# Altium project IN14.PrjPCB
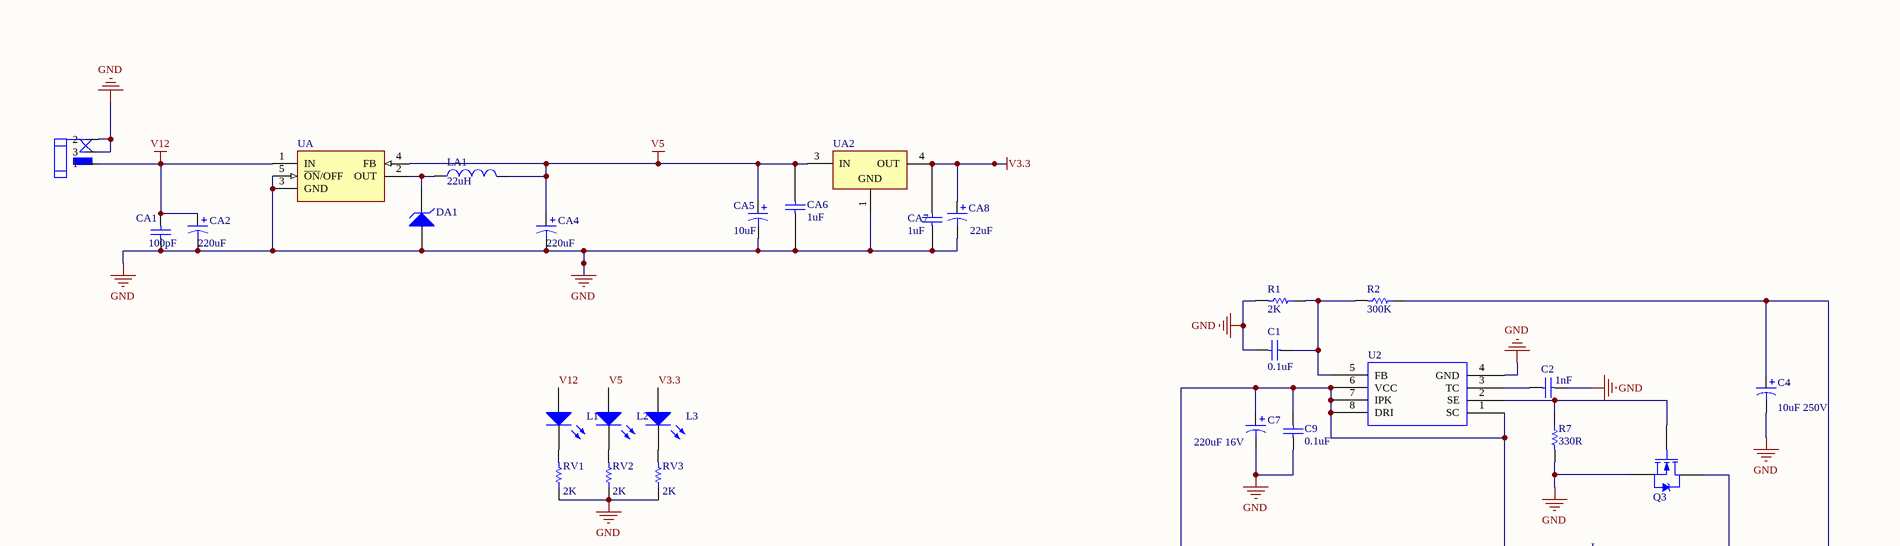
[diagram p0: IN14.SchDoc, top left]
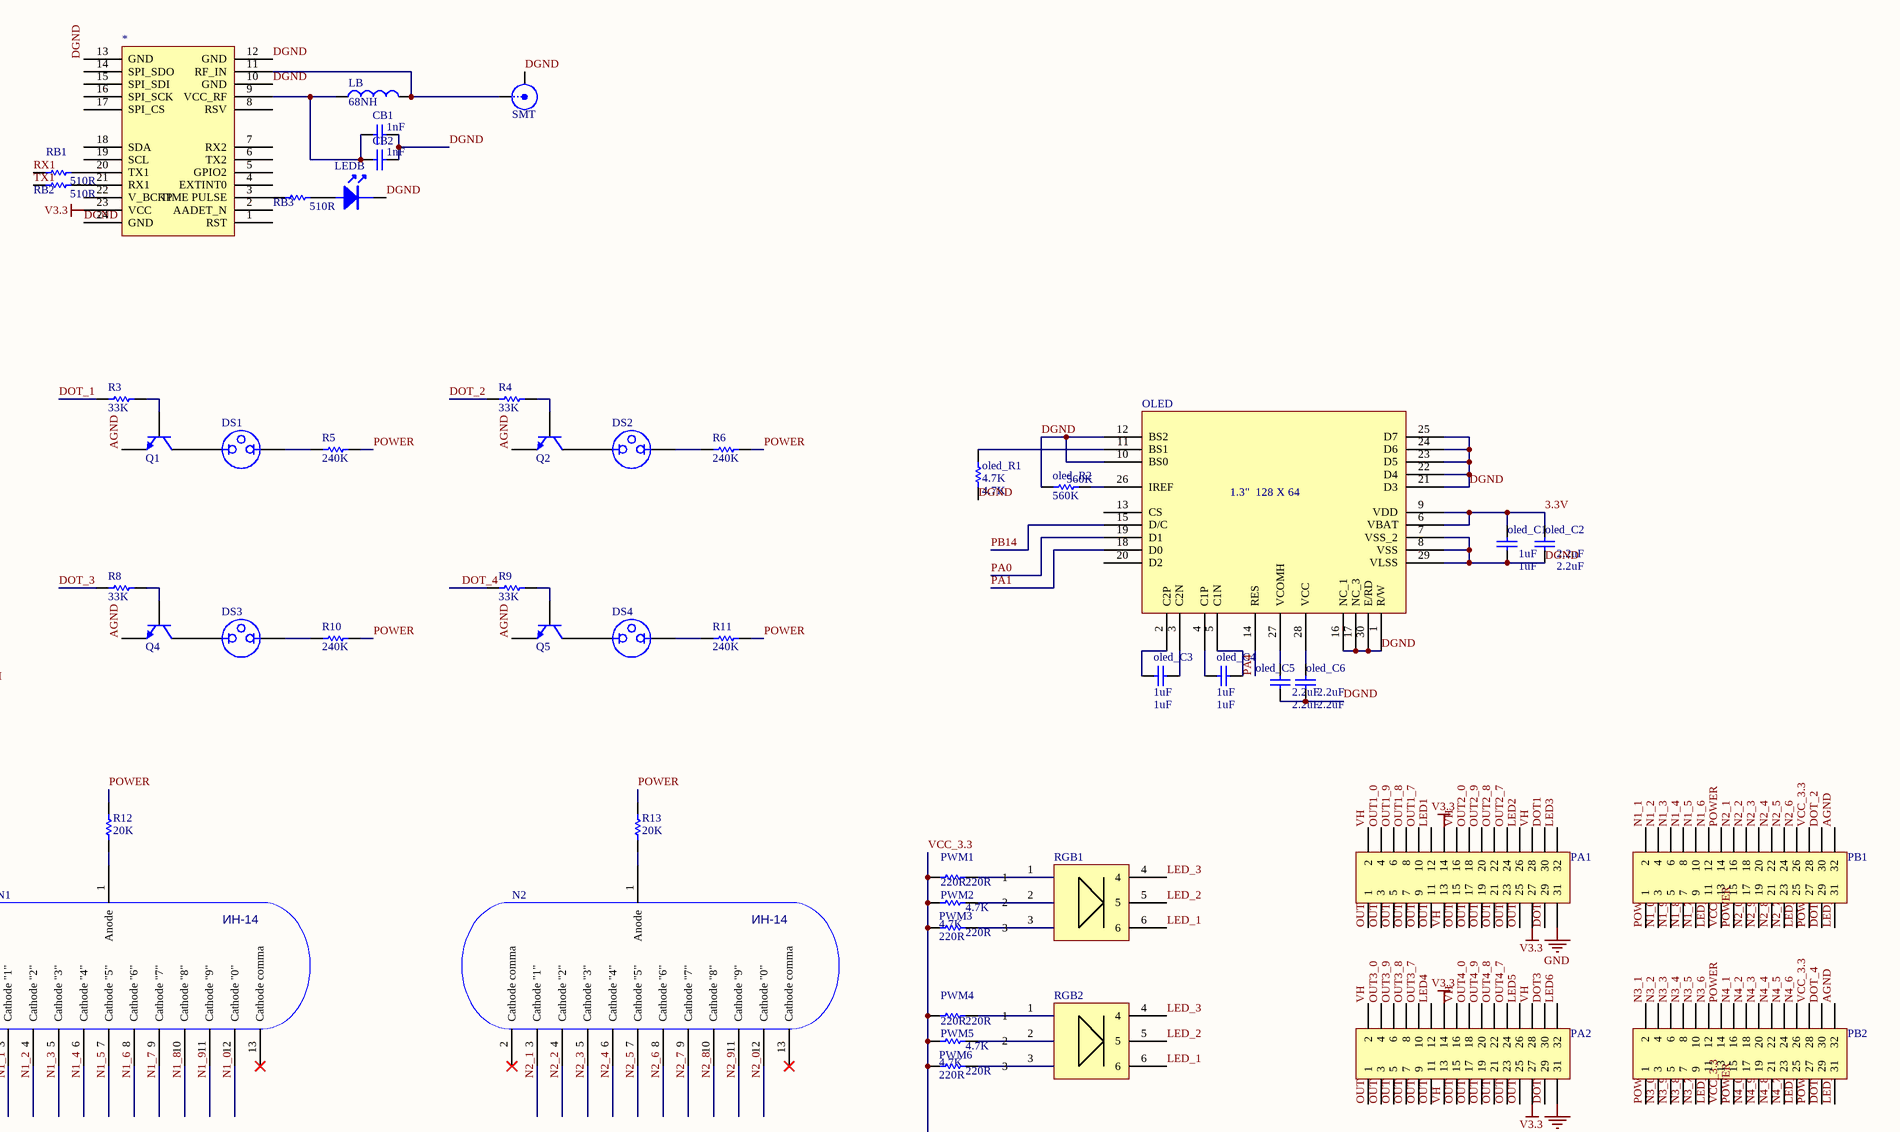
[diagram p1: IN14.SchDoc, top right]
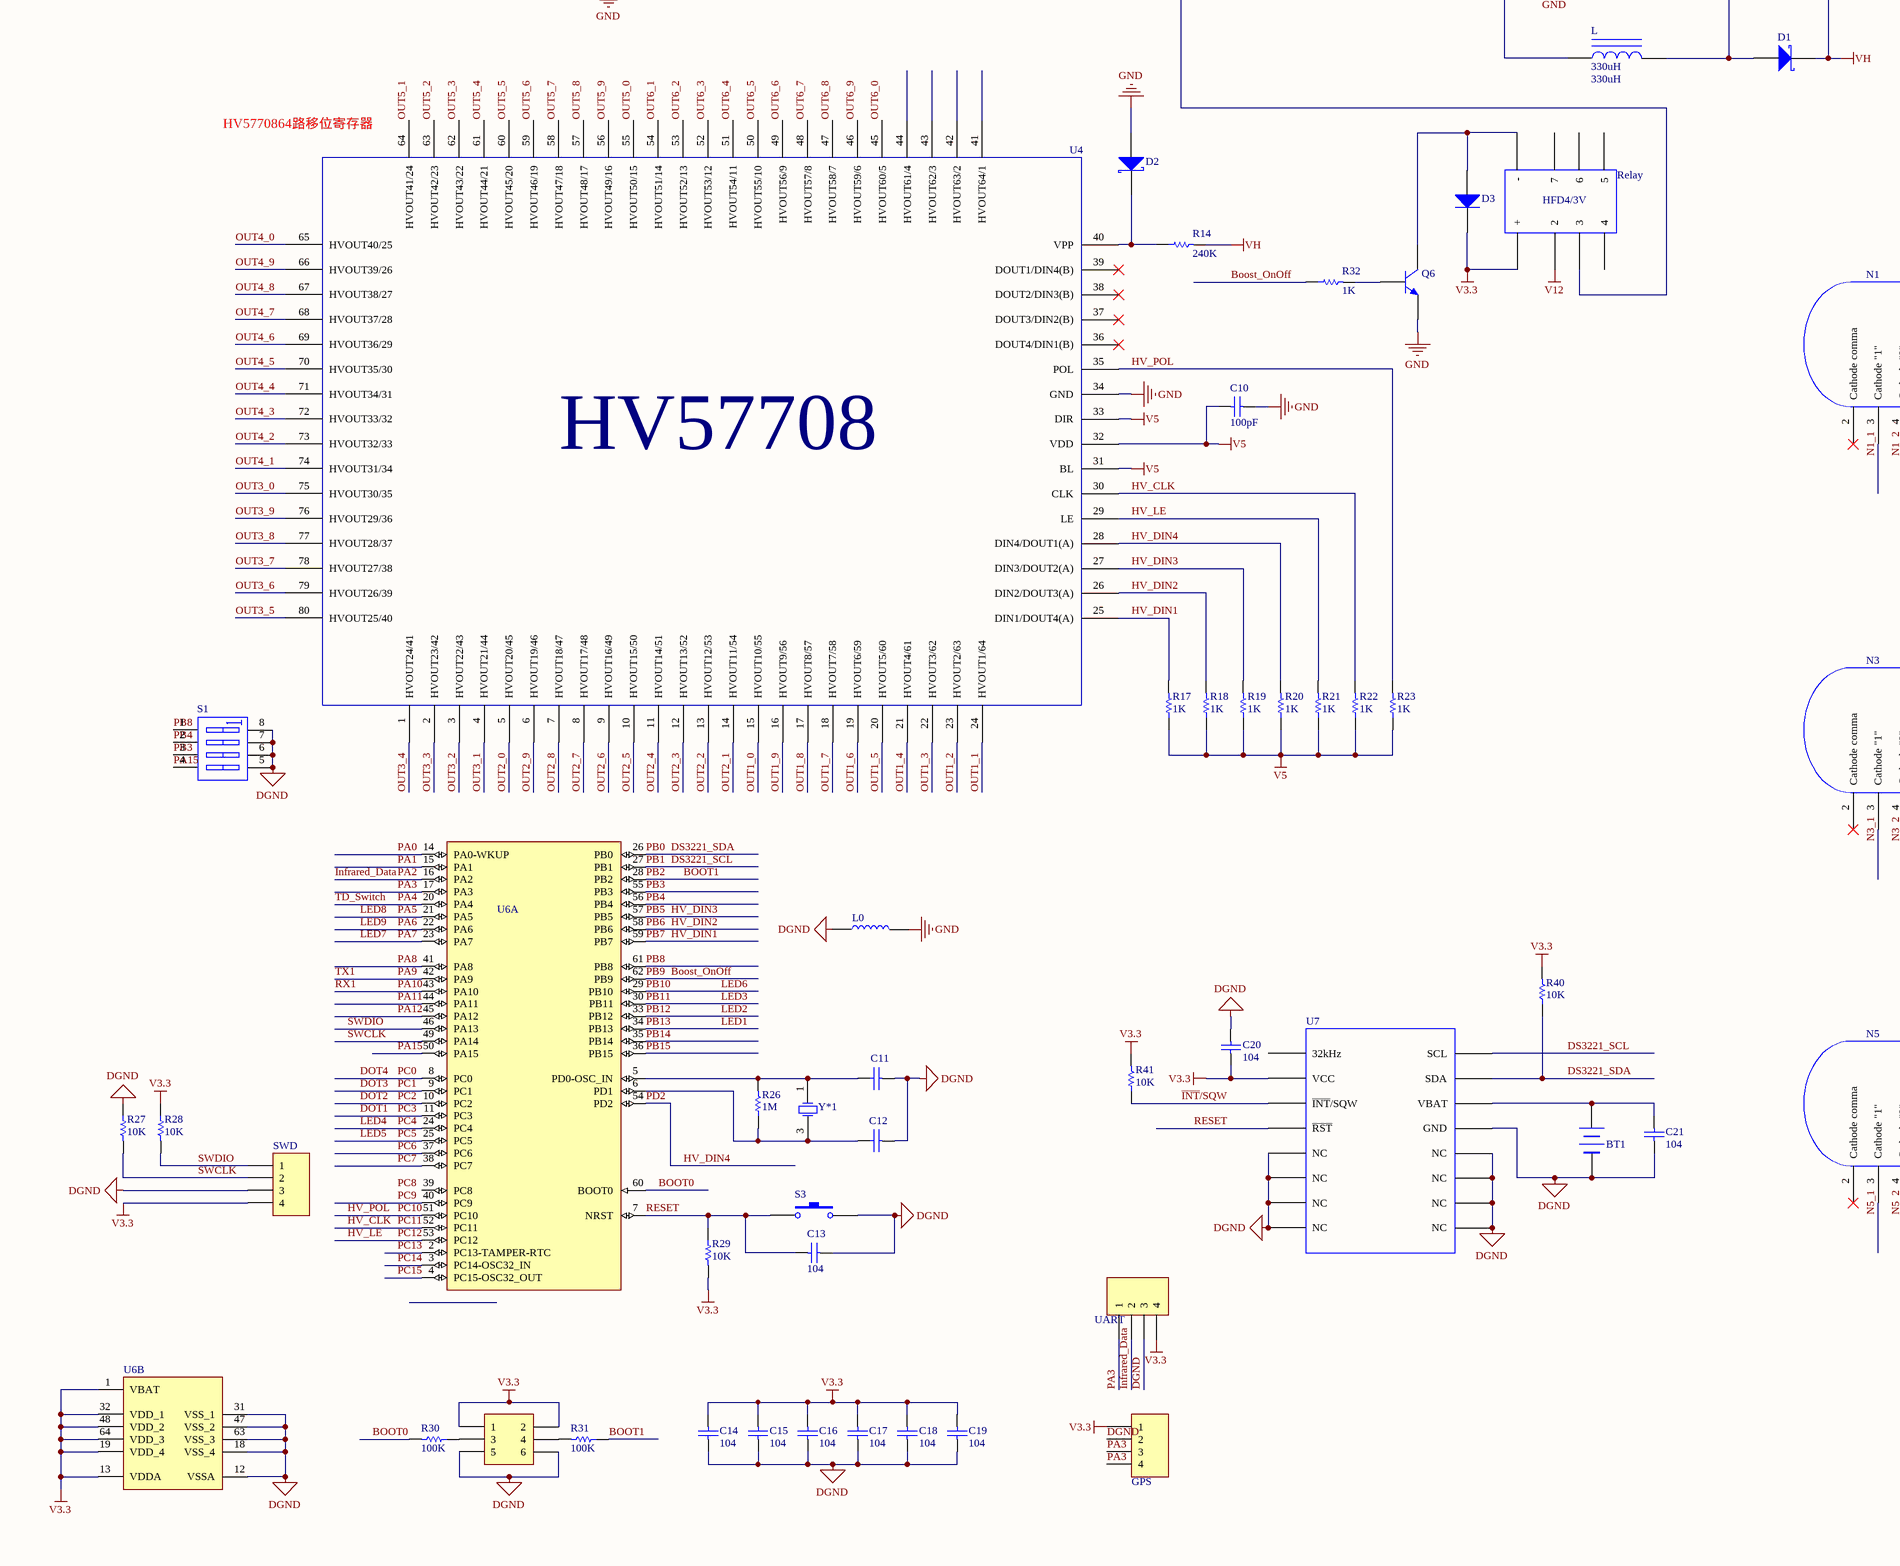
[diagram p2: IN14.SchDoc, bottom left]
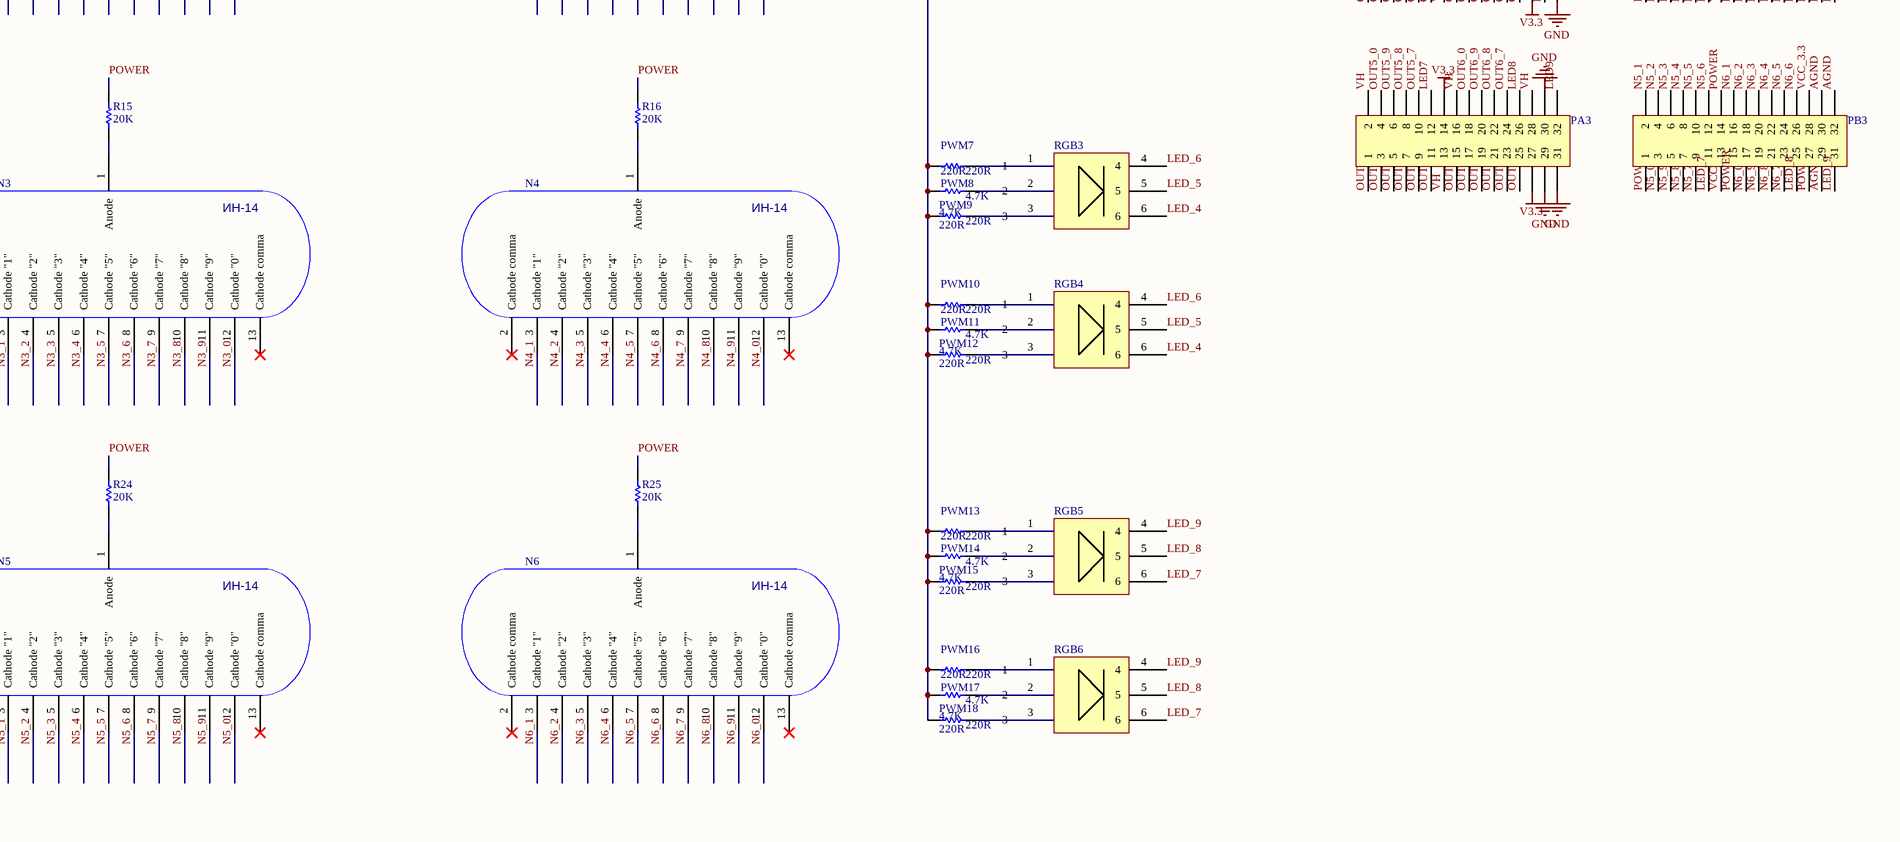
[diagram p3: IN14.SchDoc, bottom right]
1 sheet, 151 parts. Net scope: global (net labels, ports and power ports of the same name join across sheets).
Board file: IN14.PcbDoc

## Sheet IN14.SchDoc
size A1

### Parts
*  (no value)  [UM220]
BOOT  (no value)  [HDR2X3]
BT1  (no value)  [BAT1220]
C1  0.1uF  [C0603]
C2  1nF  [C0603]
C4  10uF 250V  [电容卧放2.54mm-1]
C7  220uF 16V  [HONOR_63X77]
C9  0.1uF  [C0603]
C10  100pF  [C0603]
C11  (no value)  [C0603]
C12  (no value)  [C0603]
C13  104  [C0603]
C14  104  [C0603]
C15  104  [C0603]
C16  104  [C0603]
C17  104  [C0603]
C18  104  [C0603]
C19  104  [C0603]
C20  104  [C0603]
C21  104  [C0603]
CA1  100pF  [C0603]
CA2  220uF  [CAP]
CA4  220uF  [CAP]
CA5  10uF  [3528]
CA6  1uF  [C0603]
CA7  1uF  [C0603]
CA8  22uF  [3528]
CB1  1nF  [C0603]
CB2  1nF  [C0603]
D1  (no value)  [SMB]
D2  (no value)  [LL-34]
D3  (no value)  [1N4007W]
DA1  (no value)  [3528]
DC1  (no value)  [DC-005]
DS1  (no value)  [PIN2]
DS2  (no value)  [PIN2]
DS3  (no value)  [PIN2]
DS4  (no value)  [PIN2]
GPS  Header 4  [HDR4X1_A]  (value not drawn)
L  330uH  [GDRH127]
L0  (no value)  [0805]
L1  (no value)  [C0603]
L2  (no value)  [C0603]
L3  (no value)  [C0603]
LA1  22uH  [LL]
LB  68NH  [0805]
LEDB  (no value)  [C0603]
N1  (no value)  [IN14]
N2  (no value)  [IN14]
N3  (no value)  [IN14]
N4  (no value)  [IN14]
N5  (no value)  [IN14]
N6  (no value)  [IN14]
OLED  (no value)  [OLED]
oled_C1  1uF  [C0603]
oled_C2  2.2uF  [C0603]
oled_C3  1uF  [C0603]
oled_C4  1uF  [C0603]
oled_C5  2.2uF  [C0603]
oled_C6  2.2uF  [C0603]
oled_R1  4.7K  [R0603]
oled_R2  560K  [R0603]
PA1  (no value)  [HDR2X16]
PA2  (no value)  [HDR2X16]
PA3  (no value)  [HDR2X16]
PB1  (no value)  [贴片32]
PB2  (no value)  [贴片32]
PB3  (no value)  [贴片32]
PWM1  220R  [R0603]
PWM2  4.7K  [R0603]
PWM3  220R  [R0603]
PWM4  220R  [R0603]
PWM5  4.7K  [R0603]
PWM6  220R  [R0603]
PWM7  220R  [R0603]
PWM8  4.7K  [R0603]
PWM9  220R  [R0603]
PWM10  220R  [R0603]
PWM11  4.7K  [R0603]
PWM12  220R  [R0603]
PWM13  220R  [R0603]
PWM14  4.7K  [R0603]
PWM15  220R  [R0603]
PWM16  220R  [R0603]
PWM17  4.7K  [R0603]
PWM18  220R  [R0603]
Q1  (no value)  [SOT-23-3L]
Q2  (no value)  [SOT-23-3L]
Q3  (no value)  [TO-263-2L]
Q4  (no value)  [SOT-23-3L]
Q5  (no value)  [SOT-23-3L]
Q6  (no value)  [SOT-323]
R1  2K  [R0603]
R2  300K  [R0603]
R3  33K  [R0603]
R4  33K  [R0603]
R5  240K  [R0603]
R6  240K  [R0603]
R7  value 330R  [R0603]  (hidden comment: 330)
R8  33K  [R0603]
R9  33K  [R0603]
R10  240K  [R0603]
R11  240K  [R0603]
R12  20K  [R0603]
R13  20K  [R0603]
R14  240K  [R0603]
R15  20K  [R0603]
R16  20K  [R0603]
R17  1K  [R0603]
R18  1K  [R0603]
R19  1K  [R0603]
R20  1K  [R0603]
R21  1K  [R0603]
R22  1K  [R0603]
R23  1K  [R0603]
R24  20K  [R0603]
R25  20K  [R0603]
R26  1M  [R0603]
R27  10K  [R0603]
R28  10K  [R0603]
R29  10K  [R0603]
R30  100K  [R0603]
R31  100K  [R0603]
R32  1K  [R0603]
R40  10K  [R0603]
R41  10K  [R0603]
RB1  510R  [R0603]
RB2  510R  [R0603]
RB3  510R  [R0603]
Relay  (no value)  [HFD4]
RGB1  (no value)  [二极管5050]
RGB2  (no value)  [二极管5050]
RGB3  (no value)  [二极管5050]
RGB4  (no value)  [二极管5050]
RGB5  (no value)  [二极管5050]
RGB6  (no value)  [二极管5050]
RV1  2K  [C0603]
RV2  2K  [C0603]
RV3  2K  [C0603]
S1  (no value)  [dip8]
S3  (no value)  [贴片按键（红头）]
SMT  (no value)  [SMB_V-RJ45]
SWD  (no value)  [HDR1X4]
U2  (no value)  [SOIC8]
U4  (no value)  [HV57708PG]
U6  (no value)  [LQFP64_N]  (parts A,B of 2)
U7  (no value)  [SOP16_75MM]
UA  (no value)  [TO-263-5]
UA2  (no value)  [SOT223_N]
UART  (no value)  [HDR4X1_A]
Y*1  (no value)  [A3225]

### Nets
DGND: *.10(GND) *.12(GND) *.13(GND) *.24(GND) BOOT.5 BOOT.6 BT1.2(-) C11.1 C12.1 C13.2 C14.1 C15.1 C16.1 C17.1 C18.1 C19.1 C20.2 C21.1 CB1.1 CB2.1 GPS.2 L0.1 LEDB.2 OLED.1(R/W) OLED.7(VSS_2) OLED.8(VSS) OLED.10(BS0) OLED.12(BS2) OLED.16(NC_1) OLED.17(NC_3) OLED.21(D3) OLED.22(D4) OLED.23(D5) OLED.24(D6) OLED.25(D7) OLED.29(VLSS) OLED.30(E/RD) oled_C1.1 oled_C2.1 oled_C5.1 oled_C6.1 oled_R1.1 oled_R2.1 R27.1 S1.5(B4) S1.6(B3) S1.7(B2) S1.8(B1) S3.2 SMT.2(Y) SWD.3 U6.12(VSSA) U6.18(VSS_4) U6.31(VSS_1) U6.47(VSS_2) U6.63(VSS_3) U7.5(NC) U7.6(NC) U7.7(NC) U7.8(NC) U7.9(NC) U7.10(NC) U7.11(NC) U7.12(NC) U7.13(GND) UART.3
GND: C1.2 C2.1 C4.2 C7.2 C9.1 C10.1 CA1.1 CA2.2 CA4.2 CA5.2 CA6.1 CA7.2 CA8.2 D2.1(A) DA1.1(A) DC1.2 DC1.3 L0.2 PA1.31 PA2.31 PA3.29 PA3.30 PA3.31 Q3.3(S) Q6.2(E) R1.2 R7.2 RV1.1 RV2.1 RV3.1 U2.4(GND) U4.34(GND) UA.3(GND) UA.5(~{ON}/OFF) UA2.1(GND)
V3.3: *.23(VCC) BOOT.1 BOOT.2 C14.2 C15.2 C16.2 C17.2 C18.2 C19.2 C20.1 CA7.1 CA8.1 D3.2(K) GPS.1 L3.1(A) PA1.14 PA1.27 PA2.14 PA2.27 PA3.14 PA3.27 R28.1 R29.2 R40.2 R41.2 Relay.1(+) SWD.4 U6.1(VBAT) U6.13(VDDA) U6.19(VDD_4) U6.32(VDD_1) U6.48(VDD_2) U6.64(VDD_3) U7.2(VCC) UA2.4(OUT) UART.4
V5: C10.2 CA4.1 CA5.1 CA6.2 L2.1(A) LA1.2 R17.1 R18.1 R19.1 R20.1 R21.1 R22.1 R23.1 U4.31(BL) U4.32(VDD) U4.33(DIR) UA.4(FB) UA2.3(IN)
V12: CA1.2 CA2.1 DC1.1 L1.1(A) Relay.2 UA.1(IN)
VH: C4.1 D1.2(K) PA1.2 PA1.13 PA1.16 PA1.28 PA2.2 PA2.13 PA2.16 PA2.28 PA3.2 PA3.13 PA3.16 PA3.28 R2.1 R14.2
3.3V: OLED.6(VBAT) OLED.9(VDD) oled_C1.2 oled_C2.2
~{INT}/SQW: R41.1 U7.3(~{INT}/SQW)
AGND: PB1.32 PB2.32 PB3.29 PB3.30 PB3.32 Q1.2(E) Q2.2(E) Q4.2(E) Q5.2(E)
Boost_OnOff: R32.1 U6.62(PB9)  [also labelled PB9]
BOOT0: R30.2 U6.60(BOOT0)
BOOT1: R31.1 U6.28(PB2)  [also labelled PB2]
DOT1: PA1.30 U6.11(PC3)  [also labelled PC3]
DOT2: PA1.29 U6.10(PC2)  [also labelled PC2]
DOT3: PA2.30 U6.9(PC1)  [also labelled PC1]
DOT4: PA2.29 U6.8(PC0)  [also labelled PC0]
DOT_1: PB1.29 R3.2
DOT_2: PB1.30 R4.2
DOT_3: PB2.29 R8.2
DOT_4: PB2.30 R9.2
DS3221_SCL: U6.27(PB1) U7.16(SCL)  [also labelled PB1]
DS3221_SDA: R40.1 U6.26(PB0) U7.15(SDA)  [also labelled PB0]
HV_CLK: R22.2 U4.30(CLK) U6.52(PC11)  [also labelled PC11]
HV_DIN1: R17.2 U4.25(DIN1/DOUT4(A)) U6.59(PB7)  [also labelled PB7]
HV_DIN2: R18.2 U4.26(DIN2/DOUT3(A)) U6.58(PB6)  [also labelled PB6]
HV_DIN3: R19.2 U4.27(DIN3/DOUT2(A)) U6.57(PB5)  [also labelled PB5]
HV_DIN4: R20.2 U4.28(DIN4/DOUT1(A)) U6.54(PD2)  [also labelled PD2]
HV_LE: R21.2 U4.29(LE) U6.53(PC12)  [also labelled PC12]
HV_POL: R23.2 U4.35(POL) U6.51(PC10)  [also labelled PC10]
Infrared_Data: U6.16(PA2) UART.2  [also labelled PA2]
LED1: PA1.12 U6.34(PB13)  [also labelled PB13]
LED2: PA1.26 U6.33(PB12)  [also labelled PB12]
LED3: PA1.32 U6.30(PB11)  [also labelled PB11]
LED4: PA2.12 U6.24(PC4)  [also labelled PC4]
LED5: PA2.26 U6.25(PC5)  [also labelled PC5]
LED6: PA2.32 U6.29(PB10)  [also labelled PB10]
LED7: PA3.12 U6.23(PA7)  [also labelled PA7]
LED8: PA3.26 U6.21(PA5)  [also labelled PA5]
LED9: PA3.32 U6.22(PA6)  [also labelled PA6]
LED_1: PB1.11 RGB1.6 RGB2.6
LED_2: PB1.25 RGB1.5 RGB2.5
LED_3: PB1.31 RGB1.4 RGB2.4
LED_4: PB2.11 RGB3.6 RGB4.6
LED_5: PB2.25 RGB3.5 RGB4.5
LED_6: PB2.31 RGB3.4 RGB4.4
LED_7: PB3.11 RGB5.6 RGB6.6
LED_8: PB3.25 RGB5.5 RGB6.5
LED_9: PB3.31 RGB5.4 RGB6.4
N1_0: N1.12(Cathode_"0") PB1.3
N1_1: N1.3(Cathode_"1") PB1.2
N1_2: N1.4(Cathode_"2") PB1.4
N1_3: N1.5(Cathode_"3") PB1.6
N1_4: N1.6(Cathode_"4") PB1.8
N1_5: N1.7(Cathode_"5") PB1.10
N1_6: N1.8(Cathode_"6") PB1.12
N1_7: N1.9(Cathode_"7") PB1.9
N1_8: N1.10(Cathode_"8") PB1.7
N1_9: N1.11(Cathode_"9") PB1.5
N2_0: N2.12(Cathode_"0") PB1.17
N2_1: N2.3(Cathode_"1") PB1.16
N2_2: N2.4(Cathode_"2") PB1.18
N2_3: N2.5(Cathode_"3") PB1.20
N2_4: N2.6(Cathode_"4") PB1.22
N2_5: N2.7(Cathode_"5") PB1.24
N2_6: N2.8(Cathode_"6") PB1.26
N2_7: N2.9(Cathode_"7") PB1.23
N2_8: N2.10(Cathode_"8") PB1.21
N2_9: N2.11(Cathode_"9") PB1.19
N3_0: N3.12(Cathode_"0") PB2.3
N3_1: N3.3(Cathode_"1") PB2.2
N3_2: N3.4(Cathode_"2") PB2.4
N3_3: N3.5(Cathode_"3") PB2.6
N3_4: N3.6(Cathode_"4") PB2.8
N3_5: N3.7(Cathode_"5") PB2.10
N3_6: N3.8(Cathode_"6") PB2.12
N3_7: N3.9(Cathode_"7") PB2.9
N3_8: N3.10(Cathode_"8") PB2.7
N3_9: N3.11(Cathode_"9") PB2.5
N4_0: N4.12(Cathode_"0") PB2.17
N4_1: N4.3(Cathode_"1") PB2.16
N4_2: N4.4(Cathode_"2") PB2.18
N4_3: N4.5(Cathode_"3") PB2.20
N4_4: N4.6(Cathode_"4") PB2.22
N4_5: N4.7(Cathode_"5") PB2.24
N4_6: N4.8(Cathode_"6") PB2.26
N4_7: N4.9(Cathode_"7") PB2.23
N4_8: N4.10(Cathode_"8") PB2.21
N4_9: N4.11(Cathode_"9") PB2.19
N5_0: N5.12(Cathode_"0") PB3.3
N5_1: N5.3(Cathode_"1") PB3.2
N5_2: N5.4(Cathode_"2") PB3.4
N5_3: N5.5(Cathode_"3") PB3.6
N5_4: N5.6(Cathode_"4") PB3.8
N5_5: N5.7(Cathode_"5") PB3.10
N5_6: N5.8(Cathode_"6") PB3.12
N5_7: N5.9(Cathode_"7") PB3.9
N5_8: N5.10(Cathode_"8") PB3.7
N5_9: N5.11(Cathode_"9") PB3.5
N6_0: N6.12(Cathode_"0") PB3.17
N6_1: N6.3(Cathode_"1") PB3.16
N6_2: N6.4(Cathode_"2") PB3.18
N6_3: N6.5(Cathode_"3") PB3.20
N6_4: N6.6(Cathode_"4") PB3.22
N6_5: N6.7(Cathode_"5") PB3.24
N6_6: N6.8(Cathode_"6") PB3.26
N6_7: N6.9(Cathode_"7") PB3.23
N6_8: N6.10(Cathode_"8") PB3.21
N6_9: N6.11(Cathode_"9") PB3.19
OUT1_0: PA1.4 U4.15(HVOUT10/55)
OUT1_1: PA1.1 U4.24(HVOUT1/64)
OUT1_2: PA1.3 U4.23(HVOUT2/63)
OUT1_3: PA1.5 U4.22(HVOUT3/62)
OUT1_4: PA1.7 U4.21(HVOUT4/61)
OUT1_5: PA1.9 U4.20(HVOUT5/60)
OUT1_6: PA1.11 U4.19(HVOUT6/59)
OUT1_7: PA1.10 U4.18(HVOUT7/58)
OUT1_8: PA1.8 U4.17(HVOUT8/57)
OUT1_9: PA1.6 U4.16(HVOUT9/56)
OUT2_0: PA1.18 U4.5(HVOUT20/45)
OUT2_1: PA1.15 U4.14(HVOUT11/54)
OUT2_2: PA1.17 U4.13(HVOUT12/53)
OUT2_3: PA1.19 U4.12(HVOUT13/52)
OUT2_4: PA1.21 U4.11(HVOUT14/51)
OUT2_5: PA1.23 U4.10(HVOUT15/50)
OUT2_6: PA1.25 U4.9(HVOUT16/49)
OUT2_7: PA1.24 U4.8(HVOUT17/48)
OUT2_8: PA1.22 U4.7(HVOUT18/47)
OUT2_9: PA1.20 U4.6(HVOUT19/46)
OUT3_0: PA2.4 U4.75(HVOUT30/35)
OUT3_1: PA2.1 U4.4(HVOUT21/44)
OUT3_2: PA2.3 U4.3(HVOUT22/43)
OUT3_3: PA2.5 U4.2(HVOUT23/42)
OUT3_4: PA2.7 U4.1(HVOUT24/41)
OUT3_5: PA2.9 U4.80(HVOUT25/40)
OUT3_6: PA2.11 U4.79(HVOUT26/39)
OUT3_7: PA2.10 U4.78(HVOUT27/38)
OUT3_8: PA2.8 U4.77(HVOUT28/37)
OUT3_9: PA2.6 U4.76(HVOUT29/36)
OUT4_0: PA2.18 U4.65(HVOUT40/25)
OUT4_1: PA2.15 U4.74(HVOUT31/34)
OUT4_2: PA2.17 U4.73(HVOUT32/33)
OUT4_3: PA2.19 U4.72(HVOUT33/32)
OUT4_4: PA2.21 U4.71(HVOUT34/31)
OUT4_5: PA2.23 U4.70(HVOUT35/30)
OUT4_6: PA2.25 U4.69(HVOUT36/29)
OUT4_7: PA2.24 U4.68(HVOUT37/28)
OUT4_8: PA2.22 U4.67(HVOUT38/27)
OUT4_9: PA2.20 U4.66(HVOUT39/26)
OUT5_0: PA3.4 U4.55(HVOUT50/15)
OUT5_1: PA3.1 U4.64(HVOUT41/24)
OUT5_2: PA3.3 U4.63(HVOUT42/23)
OUT5_3: PA3.5 U4.62(HVOUT43/22)
OUT5_4: PA3.7 U4.61(HVOUT44/21)
OUT5_5: PA3.9 U4.60(HVOUT45/20)
OUT5_6: PA3.11 U4.59(HVOUT46/19)
OUT5_7: PA3.10 U4.58(HVOUT47/18)
OUT5_8: PA3.8 U4.57(HVOUT48/17)
OUT5_9: PA3.6 U4.56(HVOUT49/16)
OUT6_0: PA3.18 U4.45(HVOUT60/5)
OUT6_1: PA3.15 U4.54(HVOUT51/14)
OUT6_2: PA3.17 U4.53(HVOUT52/13)
OUT6_3: PA3.19 U4.52(HVOUT53/12)
OUT6_4: PA3.21 U4.51(HVOUT54/11)
OUT6_5: PA3.23 U4.50(HVOUT55/10)
OUT6_6: PA3.25 U4.49(HVOUT56/9)
OUT6_7: PA3.24 U4.48(HVOUT57/8)
OUT6_8: PA3.22 U4.47(HVOUT58/7)
OUT6_9: PA3.20 U4.46(HVOUT59/6)
PA0: OLED.19(D1) U6.14(PA0-WKUP)
PA1: OLED.18(D0) U6.15(PA1)
PA3: GPS.3 GPS.4 U6.17(PA3) UART.1
PA4: OLED.14(RES) U6.20(PA4)  [also labelled TD_Switch]
PA8: U6.41(PA8)
PA9: RB2.1 U6.42(PA9)  [also labelled TX1]
PA10: RB1.1 U6.43(PA10)  [also labelled RX1]
PA11: U6.44(PA11)
PA12: U6.45(PA12)
PA15: S1.4(A4) U6.50(PA15)
PB3: S1.3(A3) U6.55(PB3)
PB4: S1.2(A2) U6.56(PB4)
PB8: S1.1(A1) U6.61(PB8)
PB14: OLED.15(D/C) U6.35(PB14)
PB15: U6.36(PB15)
PC6: U6.37(PC6)
PC7: U6.38(PC7)
PC9: U6.40(PC9)
PC13: U6.2(PC13-TAMPER-RTC)
PC14: U6.3(PC14-OSC32_IN)
PC15: U6.4(PC15-OSC32_OUT)
POWER: PB1.1 PB1.14 PB1.15 PB1.27 PB2.1 PB2.14 PB2.15 PB2.27 PB3.1 PB3.14 PB3.15 PB3.27 R5.2 R6.2 R10.2 R11.2 R12.2 R13.2 R15.2 R16.2 R24.2 R25.2
RESET: C13.1 R29.1 S3.1 U6.7(NRST) U7.4(~{RST})
SWCLK: R27.2 SWD.2 U6.49(PA14)
SWDIO: R28.2 SWD.1 U6.46(PA13)
VCC_3.3: PB1.13 PB1.28 PB2.13 PB2.28 PB3.13 PB3.28 PWM1.2 PWM2.2 PWM3.2 PWM4.2 PWM5.2 PWM6.2 PWM7.2 PWM8.2 PWM9.2 PWM10.2 PWM11.2 PWM12.2 PWM13.2 PWM14.2 PWM15.2 PWM16.2 PWM17.2 PWM18.2
Net*_3: *.3(TIME_PULSE) RB3.1
Net*_9: *.9(VCC_RF) CB1.2 CB2.2 LB.1
Net*_11: *.11(RF_IN) LB.2 SMT.1(X)
Net*_20: *.20(TX1) RB1.2
Net*_21: *.21(RX1) RB2.2
NetBOOT_3: BOOT.3 R30.1
NetBOOT_4: BOOT.4 R31.2
NetBT1_1: BT1.1(+) C21.2 U7.14(VBAT)
NetC1_1: C1.1 R1.1 R2.2 U2.5(FB)
NetC2_2: C2.2 U2.3(TC)
NetC7_1: C7.1 C9.2 L.1 Relay.3 U2.1(SC) U2.6(VCC) U2.7(IPK) U2.8(DRI)
NetC11_2: C11.2 R26.2 U6.5(PD0-OSC_IN) Y*1.1(OSC1)
NetC12_2: C12.2 R26.1 U6.6(PD1) Y*1.3(OSC2)
NetD1_1: D1.1(A) L.2 Q3.2(D)
NetD2_2: D2.2(K) R14.1 U4.40(VPP)
NetD3_1: D3.1(A) Q6.3(C) Relay.8(-)
NetDA1_2: DA1.2(K) LA1.1 UA.2(OUT)
NetDS1_1: DS1.1 Q1.3(C)
NetDS1_2: DS1.2 R5.1
NetDS2_1: DS2.1 Q2.3(C)
NetDS2_2: DS2.2 R6.1
NetDS3_1: DS3.1 Q4.3(C)
NetDS3_2: DS3.2 R10.1
NetDS4_1: DS4.1 Q5.3(C)
NetDS4_2: DS4.2 R11.1
NetL1_2: L1.2(K) RV1.2
NetL2_2: L2.2(K) RV2.2
NetL3_2: L3.2(K) RV3.2
NetLEDB_1: LEDB.1 RB3.2
NetN1_1: N1.1(Anode) R12.1
NetN2_1: N2.1(Anode) R13.1
NetN3_1: N3.1(Anode) R15.1
NetN4_1: N4.1(Anode) R16.1
NetN5_1: N5.1(Anode) R24.1
NetN6_1: N6.1(Anode) R25.1
NetOLED_2: OLED.2(C2P) oled_C3.1
NetOLED_3: OLED.3(C2N) oled_C3.2
NetOLED_4: OLED.4(C1P) oled_C4.1
NetOLED_5: OLED.5(C1N) oled_C4.2
NetOLED_11: OLED.11(BS1) oled_R1.2
NetOLED_26: OLED.26(IREF) oled_R2.2
NetOLED_27: OLED.27(VCOMH) oled_C5.2
NetOLED_28: OLED.28(VCC) oled_C6.2
NetPWM1_1: PWM1.1 RGB1.1
NetPWM2_1: PWM2.1 RGB1.2
NetPWM3_1: PWM3.1 RGB1.3
NetPWM4_1: PWM4.1 RGB2.1
NetPWM5_1: PWM5.1 RGB2.2
NetPWM6_1: PWM6.1 RGB2.3
NetPWM7_1: PWM7.1 RGB3.1
NetPWM8_1: PWM8.1 RGB3.2
NetPWM9_1: PWM9.1 RGB3.3
NetPWM10_1: PWM10.1 RGB4.1
NetPWM11_1: PWM11.1 RGB4.2
NetPWM12_1: PWM12.1 RGB4.3
NetPWM13_1: PWM13.1 RGB5.1
NetPWM14_1: PWM14.1 RGB5.2
NetPWM15_1: PWM15.1 RGB5.3
NetPWM16_1: PWM16.1 RGB6.1
NetPWM17_1: PWM17.1 RGB6.2
NetPWM18_1: PWM18.1 RGB6.3
NetQ1_1: Q1.1(B) R3.1
NetQ2_1: Q2.1(B) R4.1
NetQ3_1: Q3.1(G) R7.1 U2.2(SE)
NetQ4_1: Q4.1(B) R8.1
NetQ5_1: Q5.1(B) R9.1
NetQ6_1: Q6.1(B) R32.2

Not connected (* = marked no-connect by the designer): * 1(RST) 2(AADET_N) 4(EXTINT0) 5(GPIO2) 6(TX2) 7(RX2) 8(RSV) 14(SPI_SDO) 15(SPI_SDI) 16(SPI_SCK) 17(SPI_CS) 18(SDA) 19(SCL) 22(V_BCKP); N1 2(Cathode_comma)* 13(Cathode_comma)*; N2 2(Cathode_comma)* 13(Cathode_comma)*; N3 2(Cathode_comma)* 13(Cathode_comma)*; N4 2(Cathode_comma)* 13(Cathode_comma)*; N5 2(Cathode_comma)* 13(Cathode_comma)*; N6 2(Cathode_comma)* 13(Cathode_comma)*; OLED 13(CS) 20(D2); Relay 4 5 6 7; U4 36(DOUT4/DIN1(B))* 37(DOUT3/DIN2(B))* 38(DOUT2/DIN3(B))* 39(DOUT1/DIN4(B))* 41(HVOUT64/1) 42(HVOUT63/2) 43(HVOUT62/3) 44(HVOUT61/4); U6 39(PC8); U7 1(32kHz)

### Notes on the sheet
- (near U4) HV5770864路移位寄存器
- Labels drawn without touching a wire or pin: PC8
- (in symbol 1.3 inch oled) 1.3"  128 X 64
- (in symbol Relay) HFD4/3V

### Library data of the parts
* RGB1-RGB6 = Component_1
BOOT = Header 3X2: Header, 3-Pin, Dual row; LatestRevisionDate: 17-Jul-2002; LatestRevisionNote: Re-released for DXP Platform.; Publisher: Altium Limited
BT1 = BATTERY
C1 C2 C9 C13-C21 CA1 CB1 CB2 = Cap Semi: Capacitor (Semiconductor SIM Model); Published: 8-Jun-2000; LatestRevisionDate: 17-Jul-2002; LatestRevisionNote: Re-released for DXP Platform.; PackageReference: C1206; Publisher: Altium Limited
  C1 C9: Value: 0.1uF
  C2 CB1 CB2: Value: 1nF
  C13-C21: Value: 104
  CA1: Value: 100pF
C4 C7 CA5 CA8 = Cap Pol1: Polarized Capacitor (Radial); Published: 8-Jun-2000; LatestRevisionDate: 17-Jul-2002; LatestRevisionNote: Re-released for DXP Platform.; PackageReference: RB7.6-15; Publisher: Altium Limited
  C4: PackageDescription: Polarized Capacitor (Radial); 2 Leads; Value: 10uF 250V
  C7: PackageDescription: Polarized Capacitor (Radial); 2 Leads; Value: 220uF 16V
  CA5: Value: 10uF
  CA8: Value: 22uF
C10 CA6 CA7 oled_C1-oled_C6 = Cap: Capacitor; Published: 8-Jun-2000; LatestRevisionDate: 17-Jul-2002; LatestRevisionNote: Re-released for DXP Platform.; PackageReference: RAD-0.3; Publisher: Altium Limited
  C10: PackageDescription: Radial Cap, Thru-Hole; 2 Leads; 0.3 in Pin Spacing; Value: 100pF
  CA6 CA7 oled_C1 oled_C3 oled_C4: Value: 1uF
  oled_C2 oled_C5 oled_C6: Value: 2.2uF
C11 C12 = 普通电容: Capacitor
CA2 CA4 = Cap Pol3: Polarized Capacitor (Surface Mount); Published: 8-Jun-2000; LatestRevisionDate: 17-Jul-2002; LatestRevisionNote: Re-released for DXP Platform.; PackageReference: C0805; Publisher: Altium Limited; Value: 220uF
D1 = D Schottky: Schottky Diode; Published: 8-Jun-2000; LatestRevisionDate: 17-Jul-2002; LatestRevisionNote: Re-released for DXP Platform.; PackageReference: SMB; Publisher: Altium Limited; PackageDescription: DO-214-AA/SMB; 2 C-Bend Leads; Body 5.3 x 3.6 mm, inc. leads (LxW); Code_JEDEC: DO-214-AA
D2 = Diode 11DQ03: Schottky Rectifier; Published: 8-Jun-2000; LatestRevisionDate: 17-Jul-2002; LatestRevisionNote: Re-released for DXP Platform.; DatasheetVersion: Dec-1997; PackageReference: DO-204AL; Publisher: Altium Limited; PackageDescription: Diode, Axial; Body 5.2 x 2.7 mm (LxDia. max), Lead Dia. 0.86 mm (max); Code_JEDEC: DO-204-AL; ComponentLink1Description: Manufacturer Link; ComponentLink1URL: http://www.irf.com/; ComponentLink2Description: Datasheet; ComponentLink2URL: http://www.irf.com/product-info/datasheets/data/11dq03.pdf
D3 = Diode 1N4007: 1 Amp General Purpose Rectifier; Published: 8-Jun-2000; LatestRevisionDate: 17-Jul-2002; LatestRevisionNote: Re-released for DXP Platform.; DatasheetVersion: 1998; PackageVersion: Aug-1999; PackageReference: DO-41; Publisher: Altium Limited; PackageDescription: Diode, Axial; Body 5.2 x 2.7 mm (LxDia. max), Lead Dia. 0.86 mm (max); Code_JEDEC: DO-204-AL; ComponentLink1Description: Manufacturer Link; ComponentLink1URL: http://www.fairchildsemi.com/; ComponentLink2Description: Datasheet; ComponentLink2URL: http://www.fairchildsemi.com/ds/1N%2F1N4001.pdf
DA1 = D Zener: Zener Diode; Published: 8-Jun-2000; LatestRevisionDate: 17-Jul-2002; LatestRevisionNote: Re-released for DXP Platform.; Publisher: Altium Limited
DC1 = 电源插座5.4mm
DS1-DS4 = Lamp Neon: Neon Lamp; Published: 24-Mar-1999; LatestRevisionDate: 17-Jul-2002; LatestRevisionNote: Re-released for DXP Platform.; PackageReference: PIN2; Publisher: Altium Limited
GPS UART = Header 4: 接插件; LatestRevisionDate: 17-Jul-2002; LatestRevisionNote: Re-released for DXP Platform.; Publisher: Altium Limited
L = Inductor Iron: Magnetic-Core Inductor; Published: 24-Mar-1999; LatestRevisionDate: 17-Jul-2002; LatestRevisionNote: Re-released for DXP Platform.; PackageReference: AXIAL-0.9; Publisher: Altium Limited; PackageDescription: Axial Device, Thru-Hole; 2 Leads; 0.9 in Pin Spacing; Value: 330uH
L0 = L0
L1-L3 = LED2: Typical RED, GREEN, YELLOW, AMBER GaAs LED; Published: 8-Jun-2000; LatestRevisionDate: 17-Jul-2002; LatestRevisionNote: Re-released for DXP Platform.; Publisher: Altium Limited
LA1 LB = Inductor: Code_IEC: 1005; Published: 8-Jun-2000; LatestRevisionDate: 17-Jul-2002; LatestRevisionNote: Re-released for DXP Platform.; PackageReference: 0402-A; Publisher: Altium Limited; Code_JEITA: 0402
  LA1: Value: 22uH
  LB: Value: 68NH
LEDB = LED: LED发光管
N1-N6 = ИН-14
OLED = 1.3 inch oled
oled_R1 oled_R2 PWM1-PWM18 = Res1: Resistor; Published: 8-Jun-2000; LatestRevisionDate: 17-Jul-2002; LatestRevisionNote: Re-released for DXP Platform.; PackageReference: AXIAL-0.3; Publisher: Altium Limited
  oled_R1 PWM2 PWM5 PWM8 PWM11 PWM14 PWM17: Value: 4.7K
  oled_R2: Value: 560K
  PWM1 PWM3 PWM4 PWM6 PWM7 PWM9 PWM10 PWM12 PWM13 PWM15 PWM16 PWM18: Value: 220R
PA1-PA3 PB1-PB3 = Header 16X2: Header, 16-Pin, Dual row; LatestRevisionDate: 17-Jul-2002; LatestRevisionNote: Re-released for DXP Platform.; Publisher: Altium Limited
Q1 Q2 Q4-Q6 = NPN: NPN Bipolar Transistor; Published: 8-Jun-2000; LatestRevisionDate: 17-Jul-2002; LatestRevisionNote: Re-released for DXP Platform.; PackageReference: TO-226; Publisher: Altium Limited; Code_JEDEC: TO-226-AA
Q3 = NMOS-2: N-Channel Power MOSFET; Note: Pin 2 is electrically connected to pin 4.; Published: 8-Jun-2000; LatestRevisionDate: 17-Jul-2002; LatestRevisionNote: Re-released for DXP Platform.; DatasheetVersion: PD-9.814; PackageVersion: Feb-1997; PackageReference: TO-220AB; Publisher: Altium Limited; PackageDescription: TO, Thru-Hole, Vertical, Heatsink Mounted; 3 In-Line Leads; Pitch 2.54 mm; ComponentLink1Description: Manufacturer Link; ComponentLink1URL: http://www.irf.com/
R1-R32 R40 R41 RB1-RB3 RV1-RV3 = Res Semi: Semiconductor Resistor; Published: 8-Jun-2000; LatestRevisionDate: 17-Jul-2002; LatestRevisionNote: Re-released for DXP Platform.; Publisher: Altium Limited
  R1: PackageReference: AXIAL-0.5; Value: 2K
  R2: PackageReference: AXIAL-0.5; Value: 300K
  R3 R4 R8 R9: PackageReference: AXIAL-0.5; Value: 33K
  R5 R6 R10 R11 R14: PackageReference: AXIAL-0.5; Value: 240K
  R7: PackageReference: AXIAL-0.5
  R12 R13 R15 R16 R24 R25: PackageReference: AXIAL-0.5; Value: 20K
  R17-R23 R32: PackageReference: AXIAL-0.5; Value: 1K
  R26: PackageReference: AXIAL-0.5; Value: 1M
  R27-R29 R40 R41: PackageReference: AXIAL-0.5; Value: 10K
  R30 R31: PackageReference: AXIAL-0.5; Value: 100K
  RB1-RB3: PackageReference: AXIAL-0.5; Value: 510R
  RV1-RV3: Value: 2K
Relay = Relay
S1 = SW DIP-4: DIP Switch, 4 Position, SPST; Published: 24-Mar-1999; LatestRevisionDate: 29-May-2009; LatestRevisionNote: IPC-7351 Footprint Added.; PackageVersion: Dec-2002; PackageReference: SO8; Publisher: Altium Limited; PackageDescription: 8-Pin Small Outline Integrated Circuit 1.27 mm Pitch; Code_JEDEC: MS-012-AA; Code_IPC: SOIC127P600-8
S3 = SW-PB: Switch; Published: 24-Mar-1999; LatestRevisionDate: 17-Jul-2002; LatestRevisionNote: Re-released for DXP Platform.; PackageReference: SPST-2; Publisher: Altium Limited
SMT = SMB: SMB Straight Connector; LatestRevisionDate: 17-Jul-2002; LatestRevisionNote: Re-released for DXP Platform.; Publisher: Altium Limited
SWD = Header 4: Header, 4-Pin; LatestRevisionDate: 17-Jul-2002; LatestRevisionNote: Re-released for DXP Platform.; Publisher: Altium Limited
U2 = MC34063A
U4 = HV57708
U6 = STM32F103RBT6: STM32 ARM-based 32-bit MCU Performance Line with 128 kB Flash, 20 kB Internal RAM, -40 to +85°C Temperature, 64-Pin LQFP, Tray; DatasheetVersion: rev13.0, Apr-2011; PackageVersion: rev13, Apr-2011; PackageReference: LQFP64; PackageDescription: 64-Pin Low-Profile Quad Flat Pack, 10 x 10 mm Body, 0.5 mm Pitch (LQFP64); ComponentLink1Description: Manufacturer URL; ComponentLink1URL: http://www.st.com/; ComponentLink2Description: STM32F103 Datasheet; ComponentLink2URL: http://www.st.com/internet/com/TECHNICAL_RESOURCES/TECHNICAL_LITERATURE/DATASHEET/CD00161566.pdf; ComponentLink3Description: STM32 Family Web Page; ComponentLink3URL: www.st.com/stm32
U7 = DS3231
UA = LM2596T-5.0: 5V稳压芯片; Note: Tab is connected to GND; Published: 15-Apr-2002; DatasheetVersion: Dec-1997; PackageReference: TS5B; Publisher: Altium Limited; PackageDescription: D2-PAK; 5 Leads; Body 14.4 (inc. leads) x 10.4 mm (LxW max); ComponentLink1Description: Manufacturer Link; ComponentLink1URL: http://www.national.com/; ComponentLink2Description: Datasheet; ComponentLink2URL: http://www.national.com/ds.cgi/LM/LM2596.pdf; ComponentLink3Description: URL Link1; ComponentLink3URL: http://www.national.com/pf/LM/LM2596.html
UA2 = LM1117DT-3.3: 800mA Low-Dropout Linear Regulator; Manufacturer: National Semiconductor; CompType: LDO IC; PackageTopMarking: NSUZXYTT*LM1117*DT-3.3; PowerWise: N; Published: 4-Dec-2008; DatasheetVersion: Apr-2006; PackageVersion: revC, Apr-2003; PackageReference: TD03B; Publisher: Altium Limited; PackageDescription: TO252, Molded, Jedec, 6.8 x 6.10 x 2.30mm Body, 3 Lead, 2.28mm Pitch, Surface Mount; PartNumber: LM1117DT-3.3; RoHS: O; PinCount: 3; DigiKeyPartNumber: LM1117DT-3.3-ND; Code_JEDEC: TO-252-AA; ComponentLink1Description: LM1117 Datasheet; ComponentLink1URL: http://www.national.com/ds/LM/LM1117.pdf; ComponentLink2Description: LM1117 Web Page; ComponentLink2URL: http://www.national.com/pf/LM/LM1117.html; ComponentLink3Description: TD03B Package Page; ComponentLink3URL: http://www.national.com/packaging/folders/td03b.html
Y*1 = XTAL(3225): Crystal Oscillator; Published: 8-Jun-2000; LatestRevisionDate: 17-Jul-2002; LatestRevisionNote: Re-released for DXP Platform.; PackageReference: R38; Publisher: Altium Limited